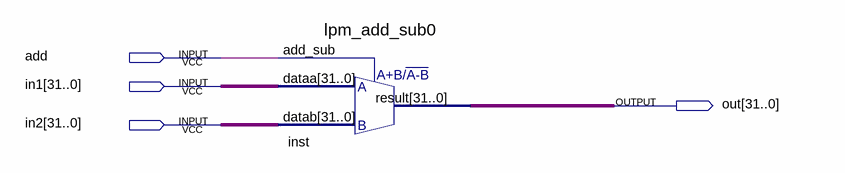
[diagram p0: schematic sheet]
// Quartus schematic add_sub.bdf as structural Verilog: 1 symbols, 4 pins
module add_sub (
  input  add,
  input  [31:0] in1,
  input  [31:0] in2,
  output [31:0] out
);

  lpm_add_sub0 inst (.dataa(in1), .datab(in2), .add_sub(add), .result(out));
endmodule
